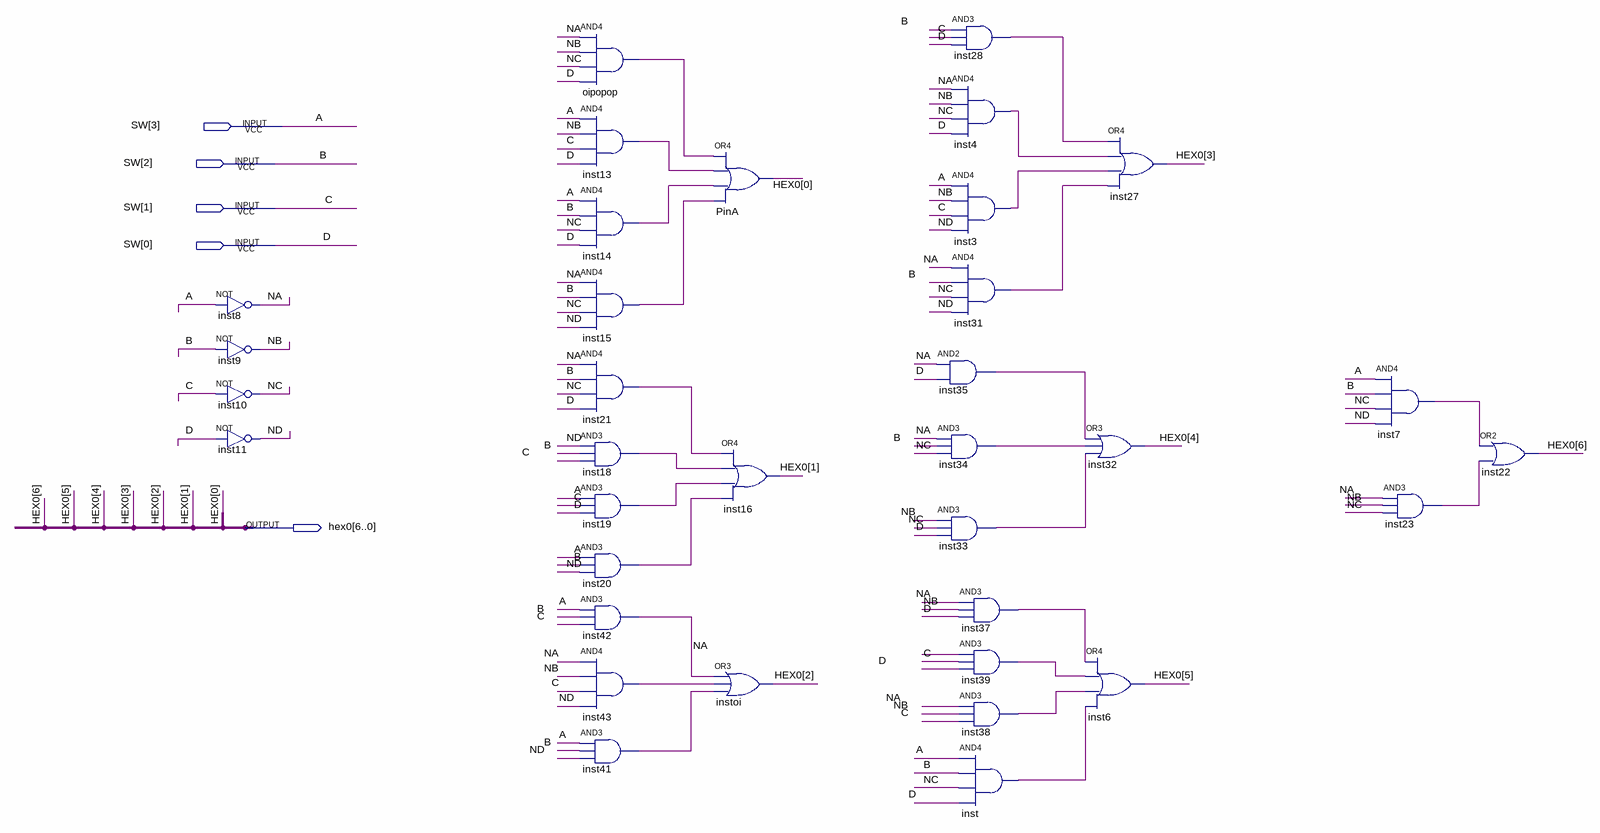
[diagram p0: schematic sheet]
// Quartus schematic hexade.bdf as structural Verilog: 35 symbols, 5 pins
module hexade (
  input  [3:0] SW,
  output [6:0] hex0
);

  wire inst3_out, inst4_out, inst7_out, inst13_out, inst14_out, inst15_out, inst18_out, inst19_out,
       inst20_out, inst21_out, inst23_out, inst28_out, inst31_out, inst33_out, inst34_out, inst35_out,
       inst37_out, inst38_out, inst39_out, inst41_out, inst42_out, inst43_out, inst_out, NA, NB, NC, ND,
       oipopop_out;

  not inst8 (NA, SW[3]);
  not inst9 (NB, SW[2]);
  not inst10 (NC, SW[1]);
  not inst11 (ND, SW[0]);
  and oipopop (oipopop_out, NA, NB, NC, SW[0]);
  and inst13 (inst13_out, SW[3], NB, SW[1], SW[0]);
  and inst14 (inst14_out, SW[3], SW[2], NC, SW[0]);
  and inst15 (inst15_out, NA, SW[2], NC, ND);
  and inst21 (inst21_out, NA, SW[2], NC, SW[0]);
  and inst18 (inst18_out, ND, SW[2], SW[1]);
  and inst19 (inst19_out, SW[3], SW[1], SW[0]);
  and inst20 (inst20_out, SW[3], SW[2], ND);
  and inst42 (inst42_out, SW[3], SW[2], SW[1]);
  and inst43 (inst43_out, NA, NB, SW[1], ND);
  and inst41 (inst41_out, SW[3], SW[2], ND);
  or PinA (hex0[0], oipopop_out, inst13_out, inst14_out, inst15_out);
  or inst16 (hex0[1], inst21_out, inst18_out, inst19_out, inst20_out);
  or instoi (hex0[2], inst42_out, inst43_out, inst41_out);
  and inst35 (inst35_out, NA, SW[0]);
  and inst34 (inst34_out, NA, SW[2], NC);
  and inst33 (inst33_out, NB, NC, SW[0]);
  and inst28 (inst28_out, SW[2], SW[1], SW[0]);
  and inst4 (inst4_out, NA, NB, NC, SW[0]);
  and inst3 (inst3_out, SW[3], NB, SW[1], ND);
  and inst31 (inst31_out, NA, SW[2], NC, ND);
  and inst37 (inst37_out, NA, NB, SW[0]);
  and inst39 (inst39_out, NA, SW[1], SW[0]);
  and inst38 (inst38_out, NA, NB, SW[1]);
  and inst (inst_out, SW[3], SW[2], NC, SW[0]);
  or inst27 (hex0[3], inst28_out, inst4_out, inst3_out, inst31_out);
  or inst32 (hex0[4], inst35_out, inst34_out, inst33_out);
  or inst6 (hex0[5], inst37_out, inst39_out, inst38_out, inst_out);
  and inst7 (inst7_out, SW[3], SW[2], NC, ND);
  and inst23 (inst23_out, NA, NB, NC);
  or inst22 (hex0[6], inst7_out, inst23_out);

  // Other names for the same wires on the sheet: A = SW[3]; B = SW[2]; C = SW[1]; D = SW[0]
endmodule
